# Altium schematic sheet ASheetSchematicTemplateWWU.SchDoc: [SheetTitle]
size A; Date: [Date]
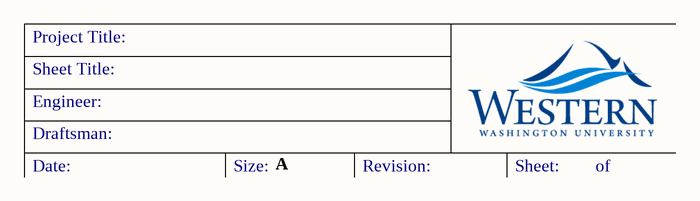
[diagram p0: ASheetSchematicTemplateWWU.SchDoc]

## Notes on the sheet
- Sheet Title:
- Project Title:
- Engineer:
- Draftsman:
- Date:
- Size:
- A
- Revision:
- Sheet:        of